# Altium schematic sheet Sheet1.SchDoc
size A
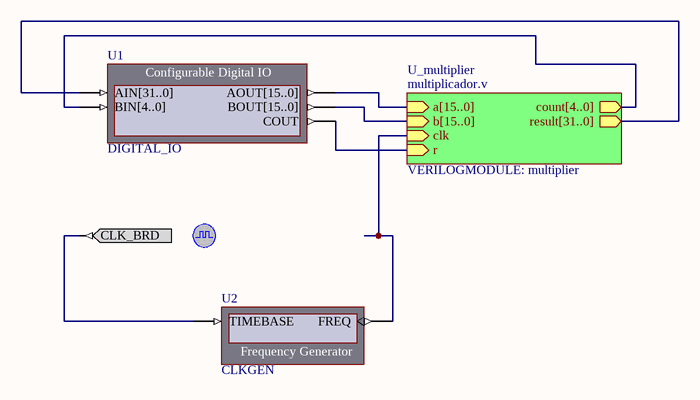
[diagram p0: Sheet1.SchDoc]

## Parts
?  CLOCK_BOARD  (value not drawn)
U1  DIGITAL_IO
U2  CLKGEN

## Sub-sheets
U_multiplier = multiplicador.v: a[15..0] (in), b[15..0] (in), clk (in), count[4..0] (out), r (in), result[31..0] (out)  | VERILOGMODULE: multiplier

## Nets
Net?_CLK_BRD: ?.CLK_BRD U2.TIMEBASE
NetU1_AIN[31..0]: U1.AIN[31..0] ; sheet U_multiplier/result[31..0]
NetU1_AOUT[15..0]: U1.AOUT[15..0] ; sheet U_multiplier/a[15..0]
NetU1_BIN[4..0]: U1.BIN[4..0] ; sheet U_multiplier/count[4..0]
NetU1_BOUT[15..0]: U1.BOUT[15..0] ; sheet U_multiplier/b[15..0]
NetU1_COUT: U1.COUT ; sheet U_multiplier/r
NetU2_FREQ: U2.FREQ ; sheet U_multiplier/clk

## Library data of the parts
? = CLOCK_BOARD: Global System Clock Supply; PortComponent: True; Published: 19-Nov-2003; Publisher: Altium Limited; HelpURL: https://wiki.altium.com/display/ADOH/NanoBoard+3000+-+System+Clocks; UseInDSF: True
U1 = DIGITAL_IO: Configurable Digital IO; NEXUS_CORE: Instrument; NEXUS_JTAG_DEVICE: True; NEXUS_JTAG_ORDER: 0; ConfigurationParameters: {}Version[2.0]{}StorageType[3]{}InterfaceType[Parallel]{}SchCompWidth[140]{}Input0Name[AIN{1}31..0{2}]{}Input0Width[32]{}Input0InitValue[0]{}Input0Kind[Numeric]{}Input0NumRadix[Decimal]{}Input1Name[BIN{1}4..0{2}]{}Input1Width[5]{}Input1InitValue[0]{}Input1Kind[LEDs]{}Input1LEDStyle[Red]{}Output0Name[AOUT{1}15..0{2}]{}Output0Width[16]{}Output0InitValue[0]{}Output0Kind[Numeric]{}Output0NumRadix[Decimal]{}Output1Name[BOUT{1}15..0{2}]{}Output1Width[16]{}Output1InitValue[0]{}Output1Kind[Numeric]{}Output1NumRadix[Decimal]{}Output2Name[COUT]{}Output2Width[1]{}Output2InitValue[0]{}Output2Kind[LEDs]{}Output2LEDStyle[Red]{}Designator[U1]{}InternalID[0]{}; ConfiguratorName: DIGITAL_IO; ComponentLink1Description: Core &Resource Usage; ComponentLink1URL: CR0134 FPGA Instrument Resource Usage.pdf; Core Revision: 1.00.00; HelpURL: https://wiki.altium.com/display/ADOH/Digital+IO+Module; LastRevisionNo: 1.00.00; Published: 28-Jun-2007; Publisher: Altium Limited; UseInDSF: True
U2 = CLKGEN: Frequency Generator; NEXUS_CORE: Instrument; NEXUS_JTAG_DEVICE: True; NEXUS_JTAG_ORDER: 0; Published: 3-Nov-2004; Publisher: Altium Limited; Core Revision: 1.00.00; ComponentLink1Description: Core &Resource Usage; ComponentLink1URL: CR0134 FPGA Instrument Resource Usage.pdf#page=2; HelpURL: https://wiki.altium.com/display/ADOH/Frequency+Generator+Module; LastRevisionNo: 1.00.00